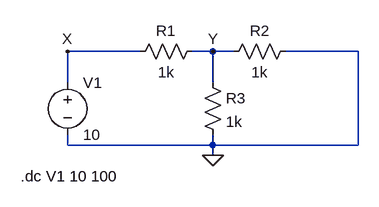
[diagram p0: schematic 1b.asc]
1b.asc, the LTspice schematic file:
Version 4
SHEET 1 880 680
WIRE 32 16 -80 16
WIRE 144 16 112 16
WIRE 176 16 144 16
WIRE 368 16 256 16
WIRE -80 64 -80 16
WIRE 144 64 144 16
WIRE -80 160 -80 144
WIRE 144 160 144 144
WIRE 144 160 -80 160
WIRE 368 160 368 16
WIRE 368 160 144 160
WIRE 144 176 144 160
FLAG 144 176 0
FLAG -80 16 X
FLAG 144 16 Y
SYMBOL res 128 0 R90
WINDOW 0 0 56 VBottom 2
WINDOW 3 32 56 VTop 2
SYMATTR InstName R1
SYMATTR Value 1k
SYMBOL res 272 0 R90
WINDOW 0 0 56 VBottom 2
WINDOW 3 32 56 VTop 2
SYMATTR InstName R2
SYMATTR Value 1k
SYMBOL res 128 48 R0
SYMATTR InstName R3
SYMATTR Value 1k
SYMBOL voltage -80 48 R0
SYMATTR InstName V1
SYMATTR Value 10
TEXT -152 208 Left 2 !.dc V1 10 100

The netlist it stands for:
* 1b.asc
R1 Y X 1k
R2 0 Y 1k
R3 Y 0 1k
V1 X 0 10
.dc V1 10 100
.backanno
.end

* Results of the author's LTspice run, read from the files saved beside the schematic
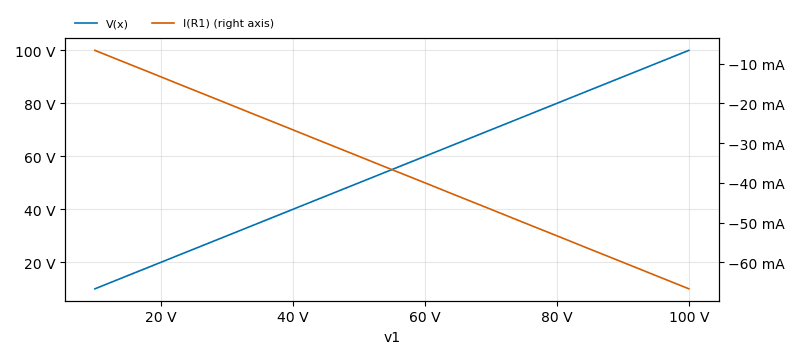
[diagram p1: DC transfer characteristic of 1b.asc, plotted from the saved traces]
* DC transfer characteristic, 1 run:
*   V(x): 10 V at v1=10 V, 100 V at v1=100 V, min 10 V, max 100 V
*   I(R1): -6.667 mA at v1=10 V, -66.67 mA at v1=100 V, min -66.67 mA, max -6.667 mA